# Altium schematic sheet Project_overview.SchDoc: Project overview
size A4; Date: Not used; ApprovedBy: Not used; CheckedBy: Not used; Author: Not used; CompanyName: STMicroelectronics; DrawnBy: Not used; Engineer: Not used; Organization: Not used; Address1: Not used; Address2: Not used; Address3: Not used; Address4: Not used; DocumentNumber: Not used; Revision: Not used; SheetNumber: 1; SheetTotal: 22; IsUserConfigurable: Not used; CurrentTime: Not used; CurrentDate: Not used; Time: Not used; DocumentFullPathAndName: Not used; DocumentName: Not used; ModifiedDate: Not used; ImagePath: Not used; ProjectName: Not used; Application_BuildNumber: Not used
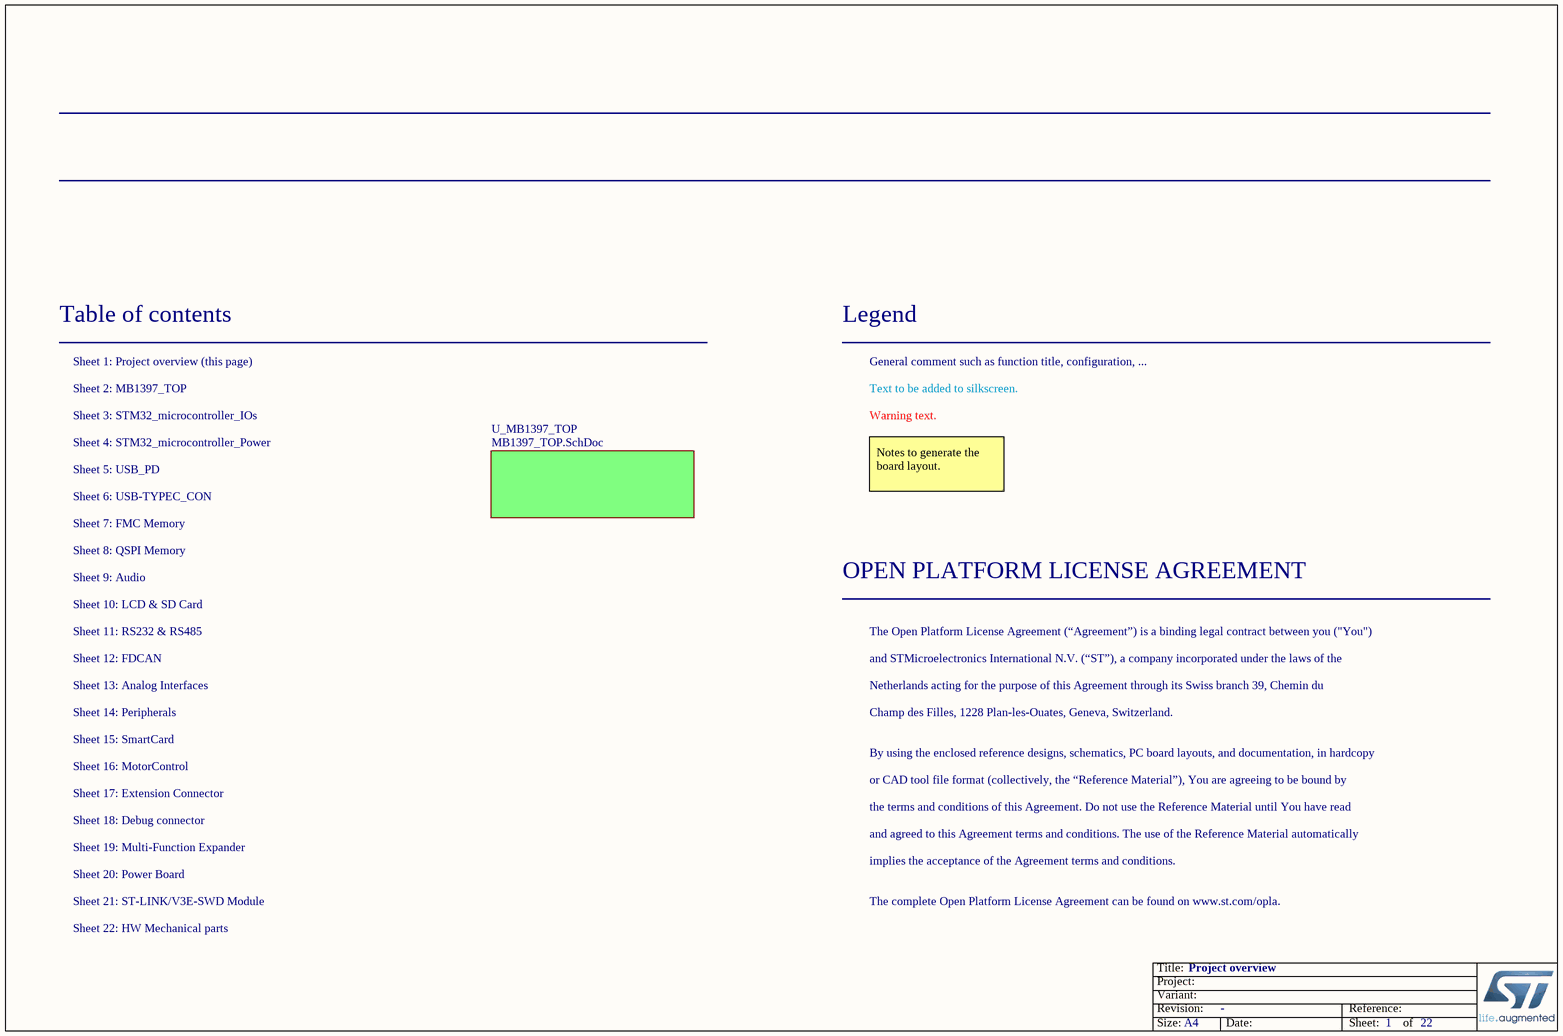
[diagram p0: Project_overview.SchDoc]

## Sub-sheets
U_MB1397_TOP = MB1397_TOP.SchDoc: no entries

## Notes on the sheet
- Table of contents
- Sheet 1: Project overview (this page)
- Legend
- General comment such as function title, configuration, ...
- Sheet 2: MB1397_TOP
- Sheet 4: STM32_microcontroller_Power
- Sheet 3: STM32_microcontroller_IOs
- Text to be added to silkscreen.
- Warning text.
- Sheet 6: USB-TYPEC_CON
- Sheet 5: USB_PD
- Notes to generate the board layout.
- Sheet 8: QSPI Memory
- Sheet 7: FMC Memory
- Sheet 9: Audio
- OPEN PLATFORM LICENSE AGREEMENT
- Sheet 10: LCD & SD Card
- Sheet 11: RS232 & RS485
- The Open Platform License Agreement (“Agreement”) is a binding legal contract between you ("You")
- Sheet 14: Peripherals
- Sheet 12: FDCAN
- Sheet 13: Analog Interfaces
- and STMicroelectronics International N.V. (“ST”), a company incorporated under the laws of the
- Netherlands acting for the purpose of this Agreement through its Swiss branch 39, Chemin du
- Champ des Filles, 1228 Plan-les-Ouates, Geneva, Switzerland.
- Sheet 16: MotorControl
- Sheet 15: SmartCard
- By using the enclosed reference designs, schematics, PC board layouts, and documentation, in hardcopy
- or CAD tool file format (collectively, the “Reference Material”), You are agreeing to be bound by
- Sheet 18: Debug connector
- Sheet 17: Extension Connector
- Sheet 19: Multi-Function Expander
- the terms and conditions of this Agreement. Do not use the Reference Material until You have read
- and agreed to this Agreement terms and conditions. The use of the Reference Material automatically
- Sheet 20: Power Board
- Sheet 21: ST-LINK/V3E-SWD Module
- implies the acceptance of the Agreement terms and conditions.
- The complete Open Platform License Agreement can be found on www.st.com/opla.
- Sheet 22: HW Mechanical parts
- Title:
- Project:
- Size:
- Revision:
- Variant:
- A4
- -
- Date:
- Reference:
- Sheet:
- of